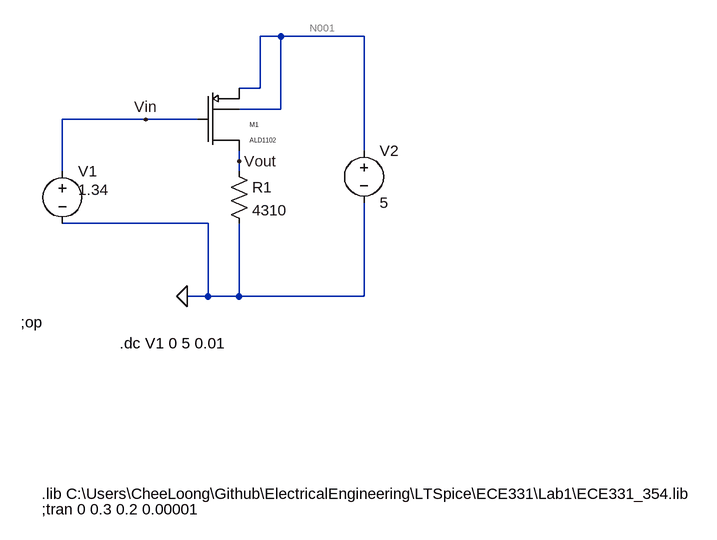
[diagram p0: schematic Lab1_2_4_Soon_Wang.asc]
Lab1_2_4_Soon_Wang.asc, the LTspice schematic file:
Version 4
SHEET 1 908 680
WIRE -176 -176 -208 -176
WIRE -48 -176 -176 -176
WIRE -208 -96 -208 -176
WIRE -208 -96 -240 -96
WIRE -176 -64 -176 -176
WIRE -176 -64 -240 -64
WIRE -384 -48 -512 -48
WIRE -304 -48 -384 -48
WIRE -48 0 -48 -176
WIRE -240 16 -240 0
WIRE -512 32 -512 -48
WIRE -240 32 -240 16
WIRE -288 112 -512 112
WIRE -288 224 -288 112
WIRE -288 224 -320 224
WIRE -240 224 -240 112
WIRE -240 224 -288 224
WIRE -48 224 -48 80
WIRE -48 224 -240 224
FLAG -320 224 0
FLAG -384 -48 Vin
FLAG -240 16 Vout
SYMBOL voltage -512 16 R0
WINDOW 123 0 0 Left 2
WINDOW 39 0 0 Left 2
WINDOW 3 24 44 Left 2
SYMATTR Value 1.34
SYMATTR InstName V1
SYMBOL res -256 16 R0
SYMATTR InstName R1
SYMATTR Value 4310
SYMBOL voltage -48 -16 R0
WINDOW 123 0 0 Left 2
WINDOW 39 0 0 Left 2
SYMATTR InstName V2
SYMATTR Value 5
SYMBOL ALD1102 -304 -96 R0
SYMATTR InstName M1
TEXT -544 528 Left 2 !.lib C:\\Users\\CheeLoong\\Github\\ElectricalEngineering\\LTSpice\\ECE331\\Lab1\\ECE331_354.lib
TEXT -544 552 Left 2 !;tran 0 0.3 0.2 0.00001
TEXT -576 264 Left 2 !;op
TEXT -424 296 Left 2 !.dc V1 0 5 0.01

The netlist it stands for:
* Lab1_2_4_Soon_Wang.asc
V1 Vin 0 1.34
R1 Vout 0 4310
V2 N001 0 5
M1 Vout Vin N001 N001 ALD1102 W=1.739e-3 L=1e-6
.model NMOS NMOS
.model PMOS PMOS
.lib standard.mos
.lib C:\Users\CheeLoong\Github\ElectricalEngineering\LTSpice\ECE331\Lab1\ECE331_354.lib
;tran 0 0.3 0.2 0.00001
;op
.dc V1 0 5 0.01
.backanno
.end

* Results of the author's LTspice run, read from the files saved beside the schematic
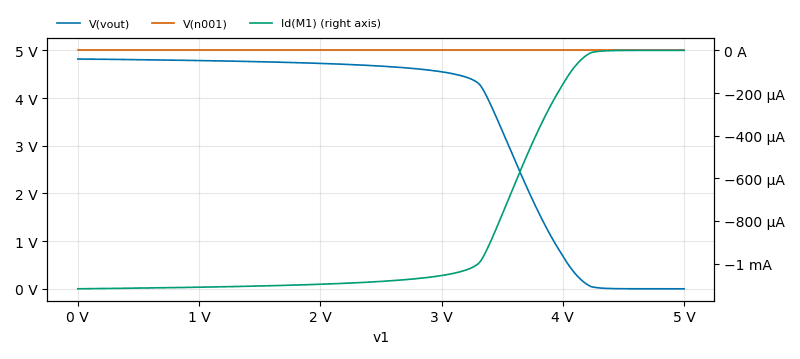
[diagram p1: DC transfer characteristic of Lab1_2_4_Soon_Wang.asc, plotted from the saved traces]
* DC transfer characteristic, 1 run:
*   V(vout): 4.819 V at v1=0 V, 2.125 µV at v1=5 V, min 2.125 µV, max 4.819 V
*   V(n001): 5 V at v1=0 V, 5 V at v1=5 V, min 5 V, max 5 V
*   Id(M1): -1.118 mA at v1=0 V, -493 pA at v1=5 V, min -1.118 mA, max -493 pA